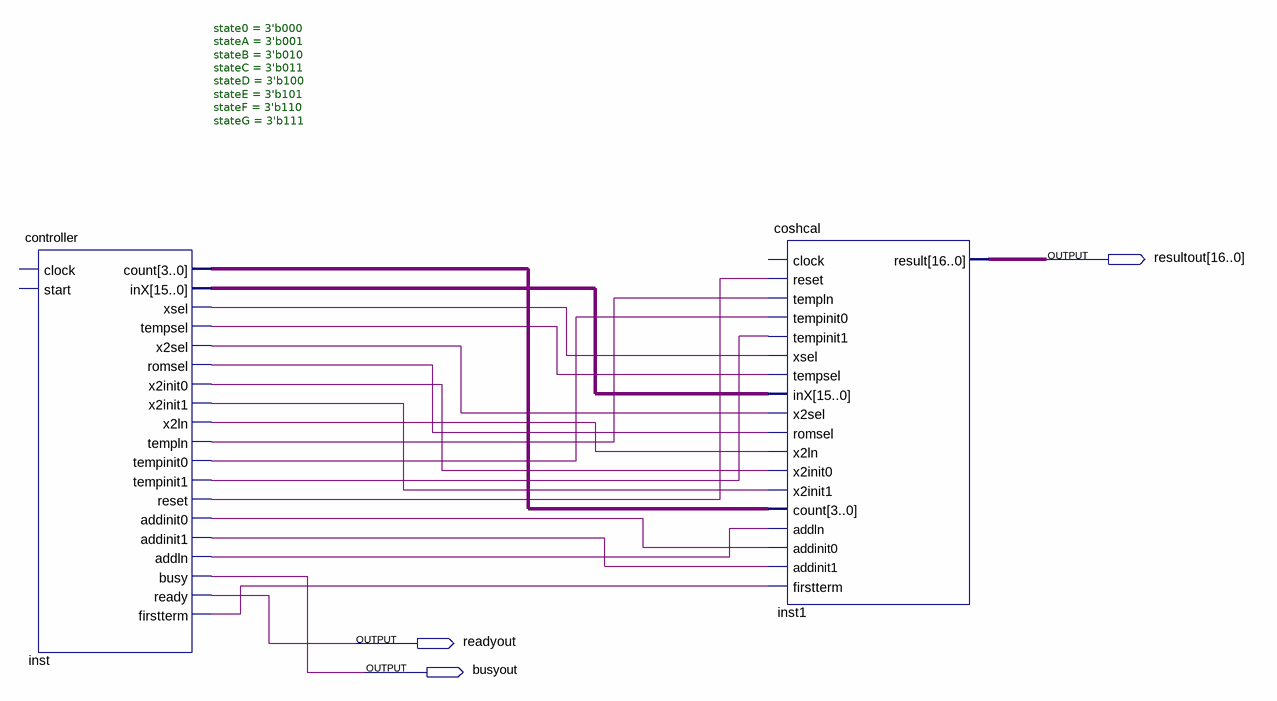
[diagram p0: schematic sheet]
// Quartus schematic coshfull.bdf as structural Verilog: 2 symbols, 3 pins
module coshfull (
  output [16:0] resultout,
  output readyout,
  output busyout
);

  wire inst_addinit0, inst_addinit1, inst_addln, inst_firstterm, inst_reset, inst_romsel, inst_tempinit0,
       inst_tempinit1, inst_templn, inst_tempsel, inst_x2init0, inst_x2init1, inst_x2ln, inst_x2sel,
       inst_xsel;
  wire [3:0] inst_count;
  wire [15:0] inst_inx;

  controller #(.state0(3'b000), .stateA(3'b001), .stateB(3'b010), .stateC(3'b011), .stateD(3'b100), .stateE(3'b101), .stateF(3'b110), .stateG(3'b111)) inst (
    .count(inst_count), .inX(inst_inx), .xsel(inst_xsel), .tempsel(inst_tempsel), .x2sel(inst_x2sel),
    .romsel(inst_romsel), .x2init0(inst_x2init0), .x2init1(inst_x2init1), .x2ln(inst_x2ln),
    .templn(inst_templn), .tempinit0(inst_tempinit0), .tempinit1(inst_tempinit1), .reset(inst_reset),
    .addinit0(inst_addinit0), .addinit1(inst_addinit1), .addln(inst_addln), .busy(busyout), .ready(readyout),
    .firstterm(inst_firstterm));  // open: clock, start
  coshcal inst1 (
    .reset(inst_reset), .templn(inst_templn), .tempinit0(inst_tempinit0), .tempinit1(inst_tempinit1),
    .xsel(inst_xsel), .tempsel(inst_tempsel), .inX(inst_inx), .x2sel(inst_x2sel), .romsel(inst_romsel),
    .x2ln(inst_x2ln), .x2init0(inst_x2init0), .x2init1(inst_x2init1), .count(inst_count), .addln(inst_addln),
    .addinit0(inst_addinit0), .addinit1(inst_addinit1), .firstterm(inst_firstterm), .result(resultout));  // open: clock
endmodule
